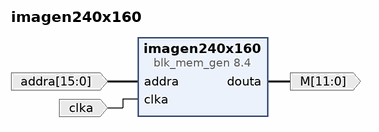
[diagram p0: block diagram of the top level]
# Vivado block design imagen240x160, xc7a35tcpg236-1, Vivado 2023.1
create_bd_design imagen240x160

create_bd_port -dir I -from 15 -to 0 addra
create_bd_port -dir I -type clk clka
create_bd_port -dir O -from 11 -to 0 M

create_bd_cell -type ip -vlnv xilinx.com:ip:blk_mem_gen:8.4 imagen240x160
set_property -dict [list \
  CONFIG.Coe_File ../../../../../../Imagen240x160.coe \
  CONFIG.Enable_A Always_Enabled \
  CONFIG.Load_Init_File true \
  CONFIG.Memory_Type Single_Port_ROM \
  CONFIG.Write_Depth_A 38400 \
  CONFIG.Write_Width_A 12 \
  CONFIG.use_bram_block Stand_Alone \
] [get_bd_cells imagen240x160]

# ---- connections ----

connect_bd_net -net addra_0_1 [get_bd_ports addra] [get_bd_pins imagen240x160/addra]
connect_bd_net -net clka_0_1 [get_bd_ports clka] [get_bd_pins imagen240x160/clka]
connect_bd_net [get_bd_pins imagen240x160/douta] [get_bd_ports M]

validate_bd_design
save_bd_design
